# EAGLE schematic attiny85_jig (EAGLE 9.3.1)
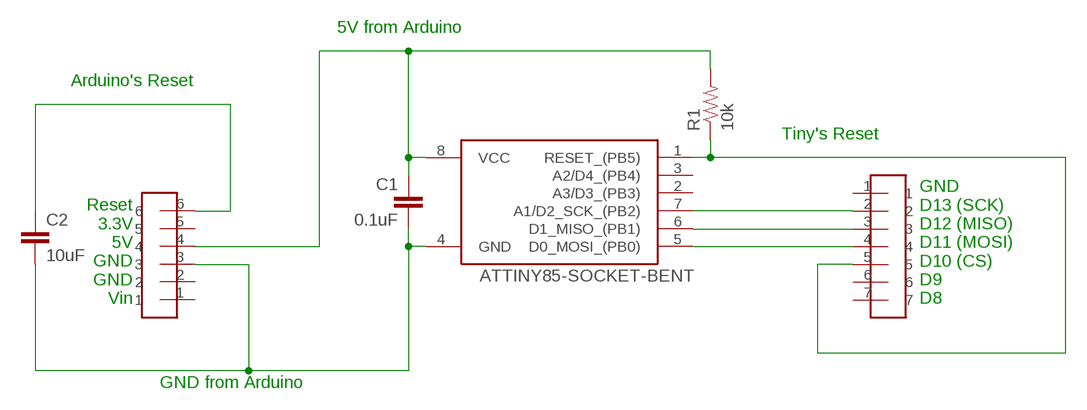
[diagram p0: schematic, sheet 1]

## Parts
C1  0.1uF  CAP-0805  [0805]
C2  10uF  CAP-0805  [0805]
R1  10k  RESISTOR-0805  [0805]
U$1  ATTINY85-SOCKET-BENT  [SOCKET-8PIN-BENT]
U$2  HEADER-6  [HEADER-6]
U$3  HEADER-7  [HEADER-7]

## Nets
5V: C1.1 R1.2 U$1.8(VCC) U$2.4
ARDUINO_RESET: C2.1 U$2.6
GND: C1.2 C2.2 U$1.4(GND) U$2.3
MISO: U$1.6(D1_MISO_(PB1)) U$3.3
MOSI: U$1.5(D0_MOSI_(PB0)) U$3.4
SCK: U$1.7(A1/D2_SCK_(PB2)) U$3.2
TINY_RESET: R1.1 U$1.1(RESET_(PB5)) U$3.5
Unconnected: U$1.2(A3/D3_(PB3)) U$1.3(A2/D4_(PB4)) U$2.1 U$2.2 U$2.5 U$3.1 U$3.6 U$3.7

## Notes on the sheet
- 5V from Arduino
- Arduino's Reset
- Tiny's Reset
- Reset
  3.3V
  5V
  GND
  GND
  Vin
- GND
  D13 (SCK)
  D12 (MISO)
  D11 (MOSI)
  D10 (CS)
  D9
  D8
- GND from Arduino

## Library data of the parts
C1 C2 = homemade-hardware:CAP: Capacitor Standard 0603 ceramic capacitor, and 0.1" leaded capacitor.
R1 = homemade-hardware:RESISTOR: Resistor Basic schematic elements and footprints for 0603, 1206, and PTH resistors.
U$1 = homemade-hardware:ATTINY85
U$2 = homemade-hardware:HEADER-6
U$3 = homemade-hardware:HEADER-7